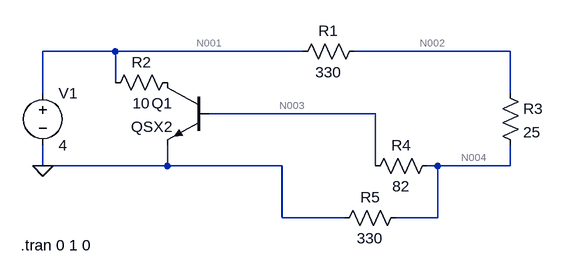
[diagram p0: schematic Draft1.asc]
Draft1.asc, the LTspice schematic file:
Version 4
SHEET 1 880 680
WIRE -80 48 -192 48
WIRE 208 48 -80 48
WIRE 528 48 288 48
WIRE -80 96 -80 48
WIRE -192 112 -192 48
WIRE 528 112 528 48
WIRE 320 144 64 144
WIRE -192 224 -192 192
WIRE 0 224 0 192
WIRE 0 224 -192 224
WIRE 176 224 0 224
WIRE 320 224 320 144
WIRE 416 224 400 224
WIRE 528 224 528 192
WIRE 528 224 416 224
WIRE 176 304 176 224
WIRE 272 304 176 304
WIRE 416 304 416 224
WIRE 416 304 352 304
FLAG -192 224 0
SYMBOL voltage -192 96 R0
WINDOW 123 0 0 Left 0
WINDOW 39 0 0 Left 0
SYMATTR InstName V1
SYMATTR Value 4
SYMBOL res 304 32 R90
WINDOW 0 0 56 VBottom 2
WINDOW 3 32 56 VTop 2
SYMATTR InstName R1
SYMATTR Value 330
SYMBOL res 512 96 R0
SYMATTR InstName R3
SYMATTR Value 25
SYMBOL res 416 208 R90
WINDOW 0 0 56 VBottom 2
WINDOW 3 32 56 VTop 2
SYMATTR InstName R4
SYMATTR Value 82
SYMBOL res 368 288 R90
WINDOW 0 0 56 VBottom 2
WINDOW 3 32 56 VTop 2
SYMATTR InstName R5
SYMATTR Value 330
SYMBOL npn 64 96 M0
SYMATTR InstName Q1
SYMATTR Value QSX2
SYMBOL res 16 80 R90
WINDOW 0 0 56 VBottom 2
WINDOW 3 32 56 VTop 2
SYMATTR InstName R2
SYMATTR Value 10
TEXT -226 346 Left 2 !.tran 0 1 0

The netlist it stands for:
* Draft1.asc
V1 N001 0 4
R1 N002 N001 330
R3 N002 N004 25
R4 N004 N003 82
R5 N004 0 330
Q1 P001 N003 0 0 QSX2
R2 P001 N001 10
.model NPN NPN
.model PNP PNP
.lib standard.bjt
.tran 0 1 0
.backanno
.end

* Results of the author's LTspice run, read from the files saved beside the schematic
* Operating Point, zero values left out:
*   V(n001) = 4 V
*   V(n002) = 1.295 V
*   V(n004) = 1.09 V
*   V(n003) = 688.7 mV
*   V(p001) = 46.69 mV
*   Ic(Q1) = 395.3 mA
*   Ib(Q1) = 4.894 mA
*   Ie(Q1) = -400.2 mA
*   I(R2) = -395.3 mA
*   I(R5) = 3.303 mA
*   I(R4) = 4.894 mA
*   I(R3) = 8.197 mA
*   I(R1) = -8.197 mA
*   I(V1) = -403.5 mA